# Altium schematic sheet schematics.SchDoc: Automatická videohlava
size A4; ApprovedBy: app by; CheckedBy: check by; Author: author; CompanyName: company; DrawnBy: Jiří Kyzlink; Organization: SPŠE Brno, Kounicova 16; Address1: L3, 12a Rodborough Rd; Address2: Frenchs Forest; Address3: NSW; Address4: Australia 2086; DocumentNumber: 1; Revision: A; SheetNumber: 1; SheetTotal: 3; DocumentName: doc name; ProjectName: hlava
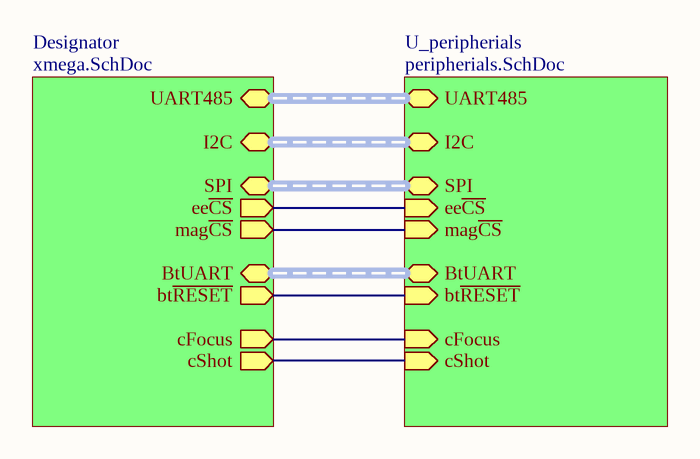
[diagram p0: schematics.SchDoc]

## Sub-sheets
Designator = xmega.SchDoc: I2C (harness I2C), UART485 (harness UART485), BtUART (harness UART), SPI (harness SPI), ee~{CS} (out), mag~{CS} (out), bt~{RESET} (out), cFocus (out), cShot (out)
U_peripherials = peripherials.SchDoc: I2C (harness I2C), UART485 (harness rs485), SPI (harness SPI), BtUART (harness UART), ee~{CS} (in), mag~{CS} (in), bt~{RESET} (in), cShot (in), cFocus (in)

## Nets
(unnamed): sheet Designator/ee~{CS}, sheet U_peripherials/ee~{CS}
(unnamed): sheet Designator/mag~{CS}, sheet U_peripherials/mag~{CS}
(unnamed): sheet Designator/bt~{RESET}, sheet U_peripherials/bt~{RESET}
(unnamed): sheet Designator/cFocus, sheet U_peripherials/cFocus
(unnamed): sheet Designator/cShot, sheet U_peripherials/cShot

## Buses and harness runs
harness sheet Designator/BtUART = sheet U_peripherials/BtUART
harness sheet Designator/I2C = sheet U_peripherials/I2C
harness sheet Designator/SPI = sheet U_peripherials/SPI
harness sheet Designator/UART485 = sheet U_peripherials/UART485

## Notes on the sheet
- Date:
- Size:
- Title
- A4
- Draw:
- Time:
- Revision:
- Sheet
- of
- File: